# EAGLE schematic main (EAGLE 8.4.1)
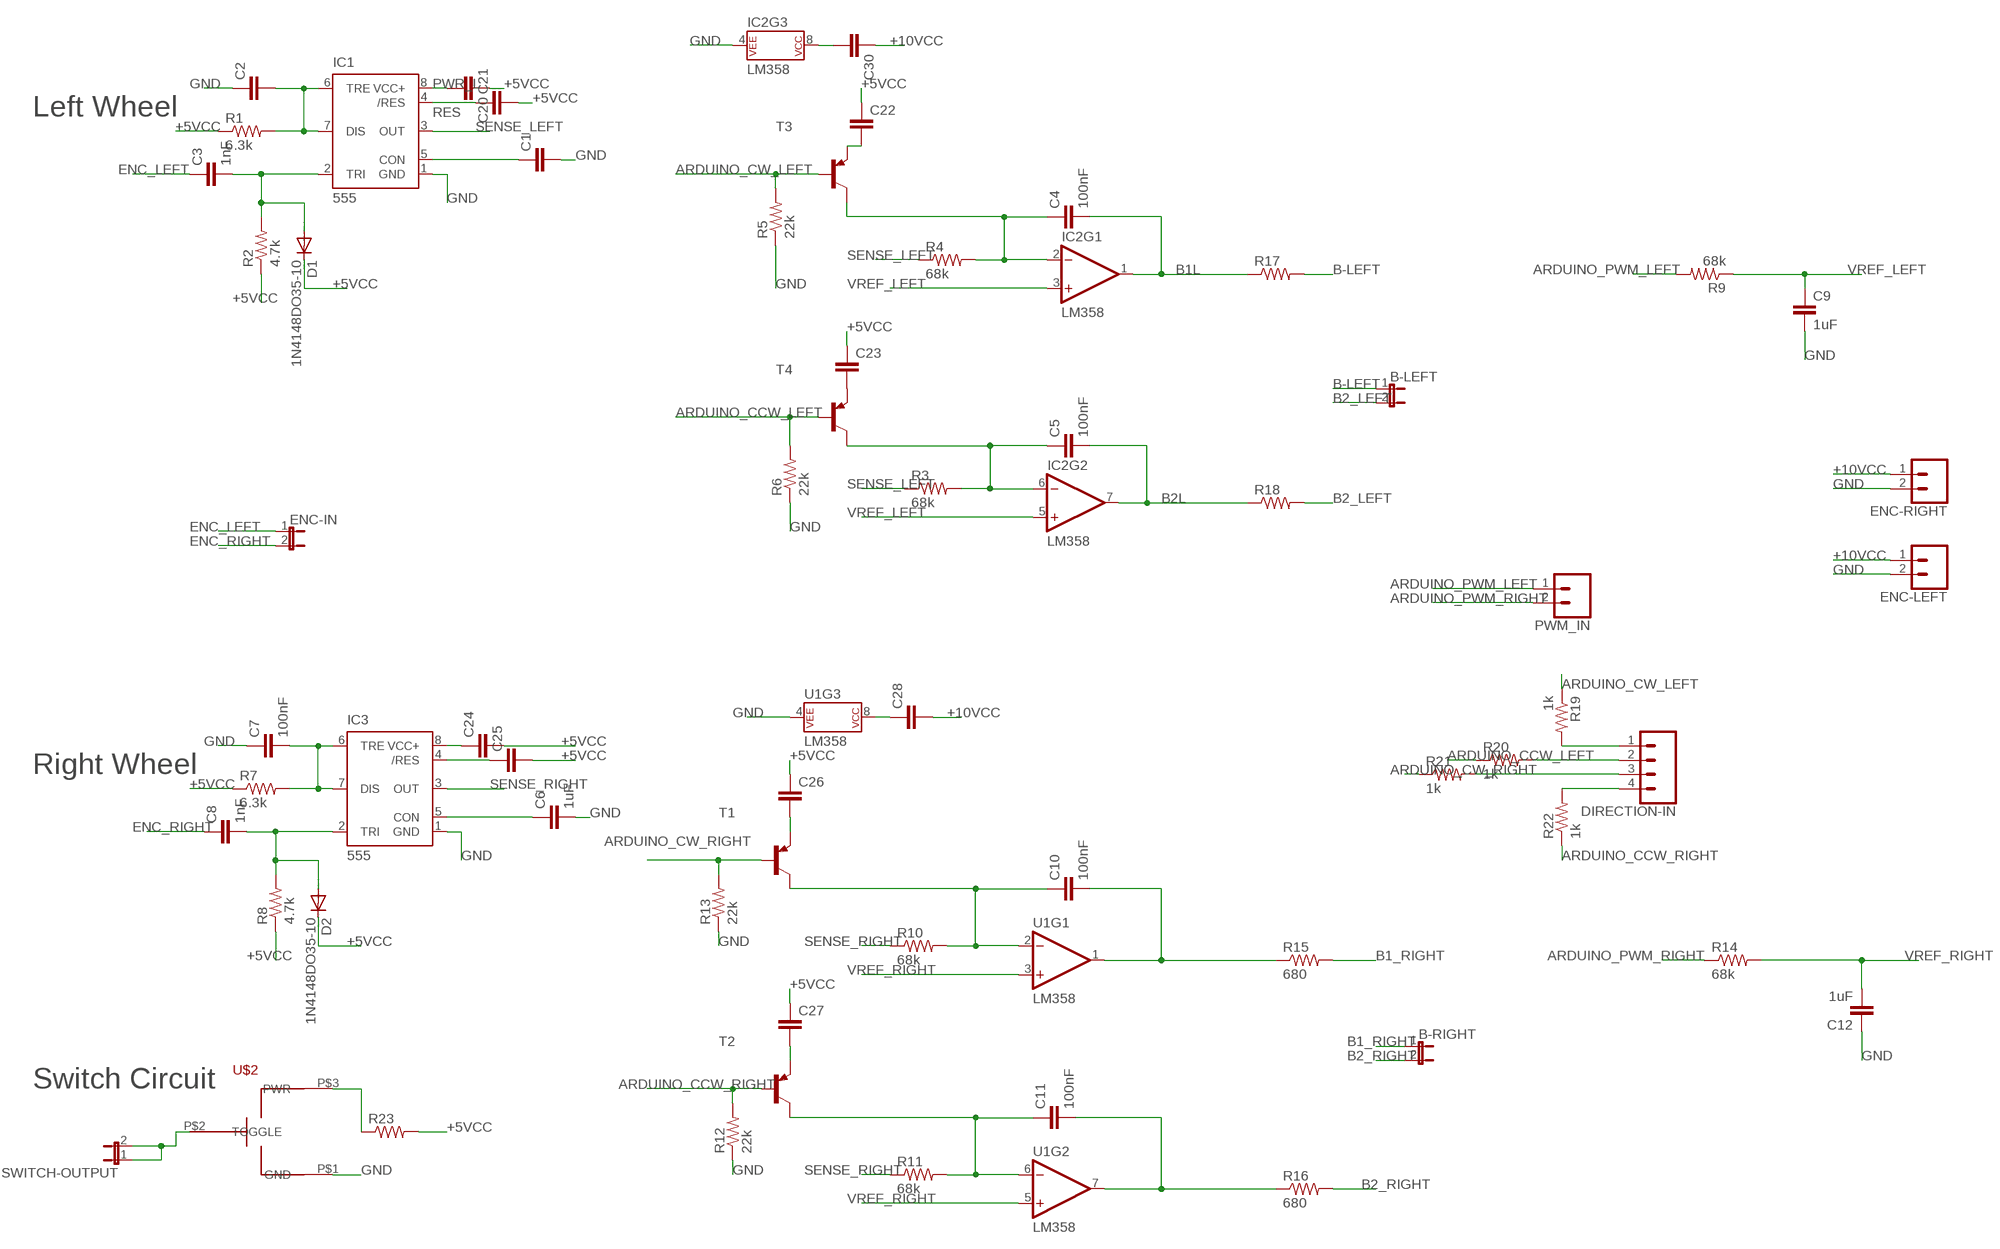
[diagram p0: schematic, sheet 1]

## Parts
B-LEFT  JUMPER-2PTH  [1X02]
B-RIGHT  JUMPER-2PTH  [1X02]
C1  C5/2.5  [C5B2.5]
C2  C5/2.5  [C5B2.5]
C3  1nF  C5/2.5  [C5B2.5]
C4  100nF  C5/2.5  [C5B2.5]
C5  100nF  C5/2.5  [C5B2.5]
C6  1uF  C5/2.5  [C5B2.5]
C7  100nF  C5/2.5  [C5B2.5]
C8  1nF  C5/2.5  [C5B2.5]
C9  1uF  C5/2.5  [C5B2.5]
C10  100nF  C5/2.5  [C5B2.5]
C11  100nF  C5/2.5  [C5B2.5]
C12  1uF  C5/2.5  [C5B2.5]
C20  C5/2.5  [C5B2.5]
C21  C5/2.5  [C5B2.5]
C22  C5/2.5  [C5B2.5]
C23  C5/2.5  [C5B2.5]
C24  C5/2.5  [C5B2.5]
C25  C5/2.5  [C5B2.5]
C26  C5/2.5  [C5B2.5]
C27  C5/2.5  [C5B2.5]
C28  C5/2.5  [C5B2.5]
C30  C5/2.5  [C5B2.5]
D1  1N4148DO35-10  [DO35-10]
D2  1N4148DO35-10  [DO35-10]
DIRECTION-IN  CONN_04  [1X04]
ENC-IN  JUMPER-2PTH  [1X02]
ENC-LEFT  CONN_02  [1X02]
ENC-RIGHT  CONN_02  [1X02]
IC1  555  555KIT  [DIP08-KIT]
IC2  LM358  [DIP08]
IC3  555  555KIT  [DIP08-KIT]
PWM_IN  CONN_02LOCK  [1X02_LOCK]
R1  6.3k  R-US_0207/10  [0207/10]
R2  4.7k  R-US_0207/10  [0207/10]
R3  68k  R-US_0207/10  [0207/10]
R4  68k  R-US_0207/10  [0207/10]
R5  22k  R-US_0207/10  [0207/10]
R6  22k  R-US_0207/10  [0207/10]
R7  6.3k  R-US_0207/10  [0207/10]
R8  4.7k  R-US_0207/10  [0207/10]
R9  68k  R-US_0207/10  [0207/10]
R10  68k  R-US_0207/10  [0207/10]
R11  68k  R-US_0207/10  [0207/10]
R12  22k  R-US_0207/10  [0207/10]
R13  22k  R-US_0207/10  [0207/10]
R14  68k  R-US_0207/10  [0207/10]
R15  680  R-US_0207/10  [0207/10]
R16  680  R-US_0207/10  [0207/10]
R17  R-US_0207/10  [0207/10]
R18  R-US_0207/10  [0207/10]
R19  1k  R-US_0207/10  [0207/10]
R20  1k  R-US_0207/10  [0207/10]
R21  1k  R-US_0207/10  [0207/10]
R22  1k  R-US_0207/10  [0207/10]
R23  R-US_0207/10  [0207/10]
SWITCH-OUTPUT  JUMPER-2PTH  [1X02]
T1  2N4126-PNP-TO92-CBE  [TO92-CBE]
T2  2N4126-PNP-TO92-CBE  [TO92-CBE]
T3  2N4126-PNP-TO92-CBE  [TO92-CBE]
T4  2N4126-PNP-TO92-CBE  [TO92-CBE]
U1  LM358  [DIP08]
U$2  SWITCH  [SWITCH]

## Nets
+5VCC: C20.1 C21.2 C22.1 C23.1 C24.2 C25.2 C26.1 C27.1 D1.C D2.C R1.1 R2.1 R7.1 R8.1 R23.2
+10VCC: C28.2 C30.1 ENC-LEFT.1 ENC-RIGHT.1
ARDUINO_CCW_LEFT: R6.2 R20.1 T4.B
ARDUINO_CCW_RIGHT: R12.2 R22.1 T2.B
ARDUINO_CW_LEFT: R5.2 R19.1 T3.B
ARDUINO_CW_RIGHT: R13.2 R21.1 T1.B
ARDUINO_PWM_LEFT: PWM_IN.1 R9.2
ARDUINO_PWM_RIGHT: PWM_IN.2 R14.1
B1_RIGHT: B-RIGHT.1 R15.2
B1L: C4.2 IC2.1(OUT) R17.1
B1R: C10.2 R15.1 U1.1(OUT)
B2_LEFT: B-LEFT.2 R18.2
B2_RIGHT: B-RIGHT.2 R16.2
B2L: C5.2 IC2.7(OUT) R18.1
B2R: C11.2 R16.1 U1.7(OUT)
B-LEFT: B-LEFT.1 R17.2
ENC_LEFT: C3.1 ENC-IN.1
ENC_RIGHT: C8.1 ENC-IN.2
GND: C1.2 C2.1 C6.2 C7.1 C9.2 C12.1 ENC-LEFT.2 ENC-RIGHT.2 IC1.1(GND) IC2.4(P$V-) IC3.1(GND) R5.1 R6.1 R12.1 R13.1 U1.4(P$V-) U$2.P$1(GND)
N$1: C1.1 IC1.5(CON)
N$2: C22.2 T3.E
N$3: C4.1 IC2.2(-IN) R4.2 T3.C
N$4: C2.2 IC1.6(TRE) IC1.7(DIS) R1.2
N$5: C23.2 T4.E
N$6: C5.1 IC2.6(-IN) R3.2 T4.C
N$7: C3.2 D1.A IC1.2(TRI) R2.2
N$8: C10.1 R10.2 T1.C U1.2(-IN)
N$9: C24.1 IC3.8(VCC+)
N$10: C26.2 T1.E
N$11: C6.1 IC3.5(CON)
N$12: C7.2 IC3.6(TRE) IC3.7(DIS) R7.2
N$13: C8.2 D2.A IC3.2(TRI) R8.2
N$14: C11.1 R11.2 T2.C U1.6(-IN)
N$15: C30.2 IC2.8(P$V+)
N$16: DIRECTION-IN.1 R19.2
N$17: DIRECTION-IN.2 R20.2
N$18: DIRECTION-IN.3 R21.2
N$19: DIRECTION-IN.4 R22.2
N$20: C27.2 T2.E
N$21: C25.1 IC3.4(/RES)
N$23: R23.1 U$2.P$3(PWR)
N$24: C28.1 U1.8(P$V+)
N$27: SWITCH-OUTPUT.1 SWITCH-OUTPUT.2 U$2.P$2(TOGGLE)
PWR_L: C20.2 IC1.8(VCC+)
RES: C21.1 IC1.4(/RES)
SENSE_LEFT: IC1.3(OUT) R3.1 R4.1
SENSE_RIGHT: IC3.3(OUT) R10.1 R11.1
VREF_LEFT: C9.1 IC2.3(+IN) IC2.5(+IN) R9.1
VREF_RIGHT: C12.2 R14.2 U1.3(+IN) U1.5(+IN)

## Notes on the sheet
- Left Wheel
- Right Wheel
- Switch Circuit

## Library data of the parts
B-LEFT B-RIGHT ENC-IN SWITCH-OUTPUT = SparkFun-Retired:JUMPER-2: Jumper Basic 0.1" spaced jumper. Use with breakaway headers.
C1-C12 C20-C28 C30 = capacitor-wima:C: CAPACITOR naming: grid - package width
D1 D2 = diode:1N4148: DIODE high speed (Philips)
DIRECTION-IN = SparkFun-Connectors:CONN_04: Multi connection point. Often used as Generic Header-pin footprint for 0.1 inch spaced/style header connections On any of the 0.1 inch spaced packages, you can populate with these: Break Away Headers - Straight <https://www.sparkfun.com/products/116> (PRT-00116) Break Away Male Headers - Right Angle <https://www.sparkfun.com/products/553> (PRT-00553) Female Headers <https://www.sparkfun.com/products/115> (PRT-00115) Break Away Headers - Machine Pin <https://www.sparkfun.com/products/117> (PRT-00117) Break Away Female Headers - Swiss Machine Pin <https://www.sparkfun.com/products/743> (PRT-00743) For SCREWTERMINALS and SPRING TERMINALS visit here: Screw Terimnals on SparkFun.com <https://www.sparkfun.com/search/results?term=Screw+Terminals> (5mm/3.5mm/2.54mm spacing) This device is also useful as a general connection point to wire up your design to another part of your project. Our various solder wires solder well into these plated through hole pads. Hook-Up Wire - Assortment (Stranded, 22 AWG) <https://www.sparkfun.com/products/11375> (PRT-11375) Hook-Up Wire - Assortment (Solid Core, 22 AWG) <https://www.sparkfun.com/products/11367> (PRT-11367) View the entire wire category on our website here <https://www.sparkfun.com/categories/141> Special notes: Molex polarized connector foot print use with SKU : PRT-08231 with associated crimp pins and housings. 1MM SMD Version SKU: PRT-10208; PROD_ID: CONN-09696
ENC-LEFT ENC-RIGHT PWM_IN = SparkFun-Connectors:CONN_02: Multi connection point. Often used as Generic Header-pin footprint for 0.1 inch spaced/style header connections On any of the 0.1 inch spaced packages, you can populate with these: Break Away Headers - Straight <https://www.sparkfun.com/products/116> (PRT-00116) Break Away Male Headers - Right Angle <https://www.sparkfun.com/products/553> (PRT-00553) Female Headers <https://www.sparkfun.com/products/115> (PRT-00115) Break Away Headers - Machine Pin <https://www.sparkfun.com/products/117> (PRT-00117) Break Away Female Headers - Swiss Machine Pin <https://www.sparkfun.com/products/743> (PRT-00743) For SCREWTERMINALS and SPRING TERMINALS visit here: Screw Terimnals on SparkFun.com <https://www.sparkfun.com/search/results?term=Screw+Terminals> (5mm/3.5mm/2.54mm spacing) This device is also useful as a general connection point to wire up your design to another part of your project. Our various solder wires solder well into these plated through hole pads. Hook-Up Wire - Assortment (Stranded, 22 AWG) <https://www.sparkfun.com/products/11375> (PRT-11375) Hook-Up Wire - Assortment (Solid Core, 22 AWG) <https://www.sparkfun.com/products/11367> (PRT-11367) View the entire wire category on our website here <https://www.sparkfun.com/categories/141> Special notes: Molex polarized connector foot print use with: PRT-08233 with associated crimp pins and housings. 2.54_SCREWTERM for use with PRT-10571. 3.5mm Screw Terminal footprints for PRT-08084 5mm Screw Terminal footprints for use with PRT-08432
IC1 IC3 = SparkFun-IC-Special-Function:555: General purpose bipolar Timer Datasheet <http://www.sparkfun.com/datasheets/Components/General/ne555.pdf> SparkFun Products SparkFun SparkPunk Sequencer Kit <https://www.sparkfun.com/products/12707> (KIT-12707) Storefront Component: 555 Timer <https://www.sparkfun.com/products/9273> (COM-09273) Two parts valid for production: VFP: IC-11930 (M7555 PTH) VFP: IC-09173 (555 PTH) - Preferred; PROD_ID: IC-09173; PROD_ID_ALT: IC-11930
IC2 U1 = SparkFun-IC-Amplifiers:LM358: LM358 Jellybean op-amp Datasheet <http://www.sparkfun.com/datasheets/Components/General/LM358.pdf> SparkFun Products Op-Amp (Thru-Hole) - LM358 <https://www.sparkfun.com/products/9456> (COM-09456); PROD_ID: IC-09172
R1-R23 = resistor:R-US_: RESISTOR, American symbol
T1-T4 = transistor:*-PNP-: PNP Transistror
U$2 = mySwitch:SWITCH